# Altium schematic sheet Sheet1.SchDoc
size A4
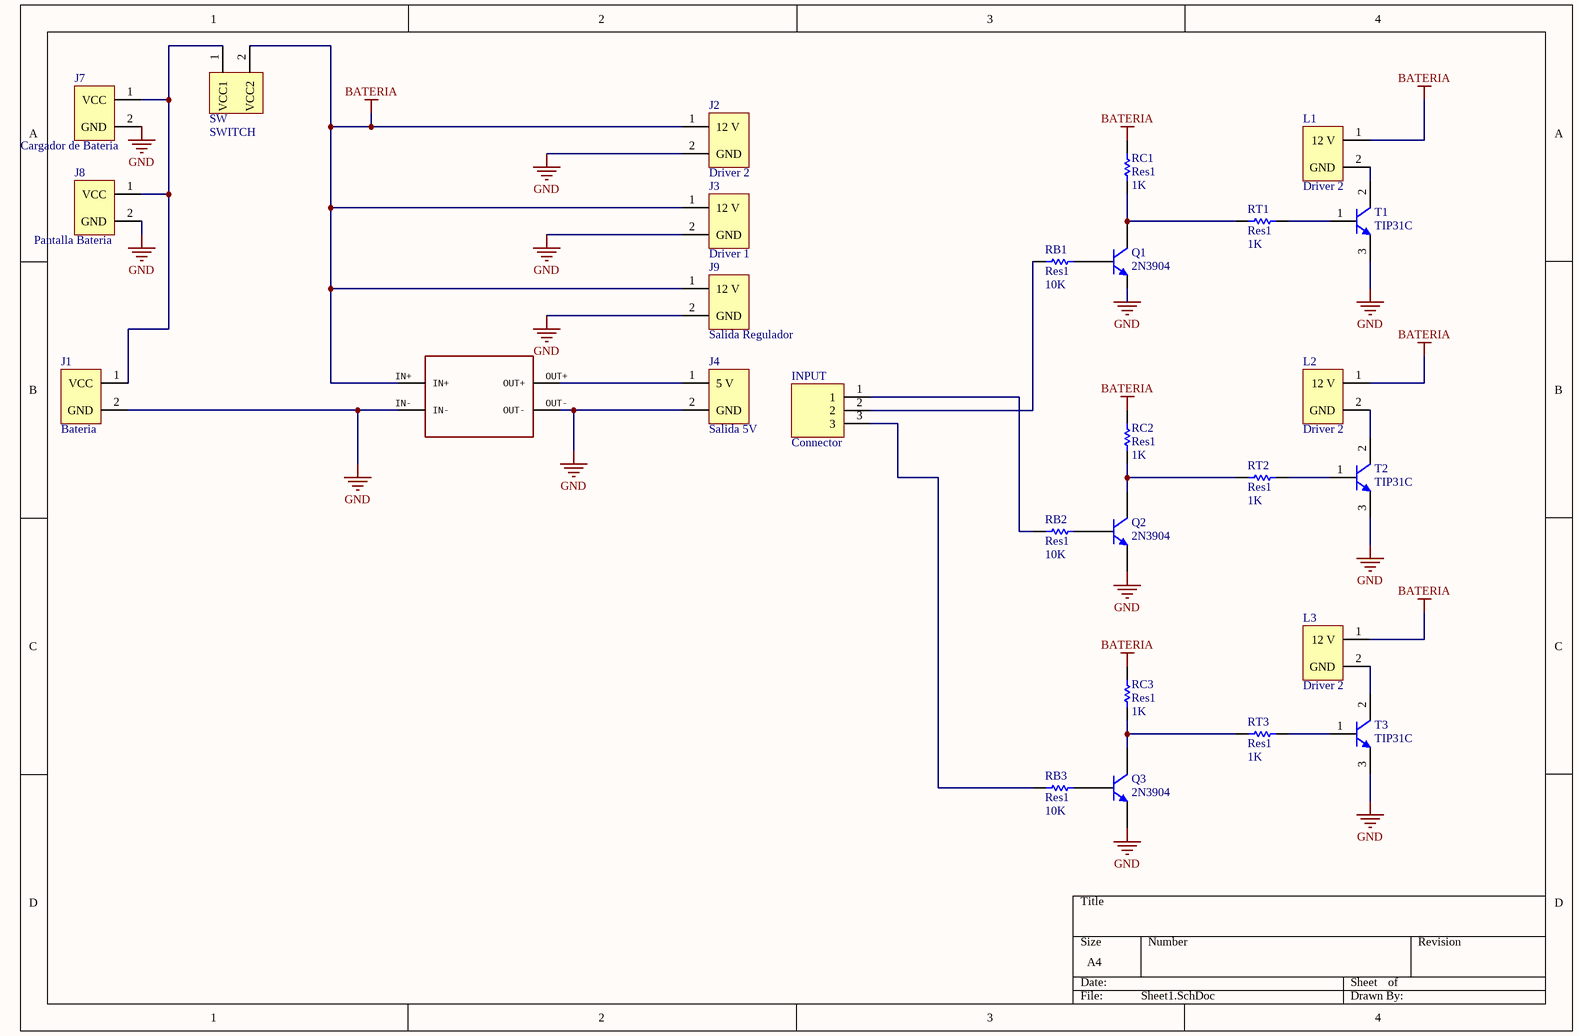
[diagram p0: Sheet1.SchDoc]

## Parts
INPUT  Connector  [1x3x2.54 Pin Header TH V]
J1  Bateria  [CONN2]
J2  Driver 2  [CONN2]
J3  Driver 1  [CONN2]
J4  Salida 5V  [CONN2]
J7  Cargador de Bateria  [CONN2]
J8  Pantalla Bateria  [CONN2]
J9  Salida Regulador  [CONN2]
L1  Driver 2  [CONN2]
L2  Driver 2  [CONN2]
L3  Driver 2  [CONN2]
Q1  2N3904  [TO-92A]
Q2  2N3904  [TO-92A]
Q3  2N3904  [TO-92A]
RB1  Res1  value 10K  [AXIAL-0.3]
RB2  Res1  value 10K  [AXIAL-0.3]
RB3  Res1  value 10K  [AXIAL-0.3]
RC1  Res1  value 1K  [AXIAL-0.3]
RC2  Res1  value 1K  [AXIAL-0.3]
RC3  Res1  value 1K  [AXIAL-0.3]
REG1  Voltage regulator IN: 7-35V OUT: ADJ  [CP8-ADJ]  (value not drawn)
RT1  Res1  value 1K  [AXIAL-0.3]
RT2  Res1  value 1K  [AXIAL-0.3]
RT3  Res1  value 1K  [AXIAL-0.3]
SW  SWITCH  [CONN2]
T1  TIP31C  [ONSC-TO-220-3-221A-09]
T2  TIP31C  [ONSC-TO-220-3-221A-09]
T3  TIP31C  [ONSC-TO-220-3-221A-09]

## Nets
BATERIA: J2.1(12_V) J3.1(12_V) J9.1(12_V) L1.1(12_V) L2.1(12_V) L3.1(12_V) RC1.2 RC2.2 RC3.2 REG1.IN+ SW.2(VCC2)
GND: J1.2(GND) J2.2(GND) J3.2(GND) J4.2(GND) J7.2(GND) J8.2(GND) J9.2(GND) Q1.1(E) Q2.1(E) Q3.1(E) REG1.IN- REG1.OUT- T1.3(E) T2.3(E) T3.3(E)
NetINPUT_1: INPUT.1 RB2.1
NetINPUT_2: INPUT.2 RB1.1
NetINPUT_3: INPUT.3 RB3.1
NetJ1_1: J1.1(VCC) J7.1(VCC) J8.1(VCC) SW.1(VCC1)
NetJ4_1: J4.1(5_V) REG1.OUT+
NetL1_2: L1.2(GND) T1.2(C)
NetL2_2: L2.2(GND) T2.2(C)
NetL3_2: L3.2(GND) T3.2(C)
NetQ1_2: Q1.2(B) RB1.2
NetQ1_3: Q1.3(C) RC1.1 RT1.1
NetQ2_2: Q2.2(B) RB2.2
NetQ2_3: Q2.3(C) RC2.1 RT2.1
NetQ3_2: Q3.2(B) RB3.2
NetQ3_3: Q3.3(C) RC3.1 RT3.1
NetRT1_2: RT1.2 T1.1(B)
NetRT2_2: RT2.2 T2.1(B)
NetRT3_2: RT3.2 T3.1(B)

## Library data of the parts
INPUT = Header 1x3
J1-J4 J7-J9 L1-L3 SW = Bornera
Q1-Q3 = 2N3904: NPN General Purpose Amplifier; Published: 8-Jun-2000; LatestRevisionDate: 15-Jan-2003; LatestRevisionNote: PCB Footprint 'BCY-W3/D4.7' replaced; DatasheetVersion: 1997; PackageVersion: Sep-1998; PackageReference: TO-92A; Publisher: Altium Limited; PackageDescription: TO, Flat Index; 3 In-Line, Axial Leads; Body Dia. 4.5mm; Leads 0.51 x 0.48 mm (max); ComponentLink1Description: Manufacturer Link; ComponentLink1URL: http://www.fairchildsemi.com/; ComponentLink2Description: Datasheet; ComponentLink2URL: http://www.fairchildsemi.com/ds/2N%2F2N3904.pdf
RB1-RB3 RC1-RC3 RT1-RT3 = Res1: Resistor; Published: 8-Jun-2000; LatestRevisionDate: 17-Jul-2002; LatestRevisionNote: Re-released for DXP Platform.; PackageReference: AXIAL-0.3; Publisher: Altium Limited; PackageDescription: Axial Device, Thru-Hole; 2 Leads; 0.3 in Pin Spacing
REG1 = CP8-ADJ: GateName_1: G$1; SymbolName_1: VREG-CP8; LibraryName: userlib; DeviceSetName: CP8-ADJ; Package: CP8-ADJ
T1-T3 = CMP-1048-00031-1: Complementary Silicon Plastic Power Transistor, 3-Pin TO-220, Tube; Manufacturer: On Semiconductor; fT Min (MHz): 3; Polarity: NPN; PackageVersion: Rev. AG, 09/2011; Packing: Tube; ComponentLink2URL: http://www.onsemi.com/pub_link/Collateral/TIP31A-D.PDF; ComponentLink1Description: Manufacturer URL; IC Continuous (A): 3; ComponentLink2Description: Datasheet; PartNumber: TIP31C; ComponentLink3URL: http://www.onsemi.com/pub_link/Collateral/221A-09.PDF; DatasheetVersion: Rev. 14; RoHS: FALSE; ComponentLink3Description: Package Specification; PackageReference: TO-220-3-221A-09; PackageDescription: 3-Pin Flange Mount, Vertical Straight Lead, Body 9.97 x 4.445 mm, Pitch 2.54 mm; ComponentLink1URL: http://www.onsemi.com/; Mounting Technology: Through Hole